# EAGLE design K-Diag small- single_small-multi2 (EAGLE 6.5.0)

## Sheet 1 of 9
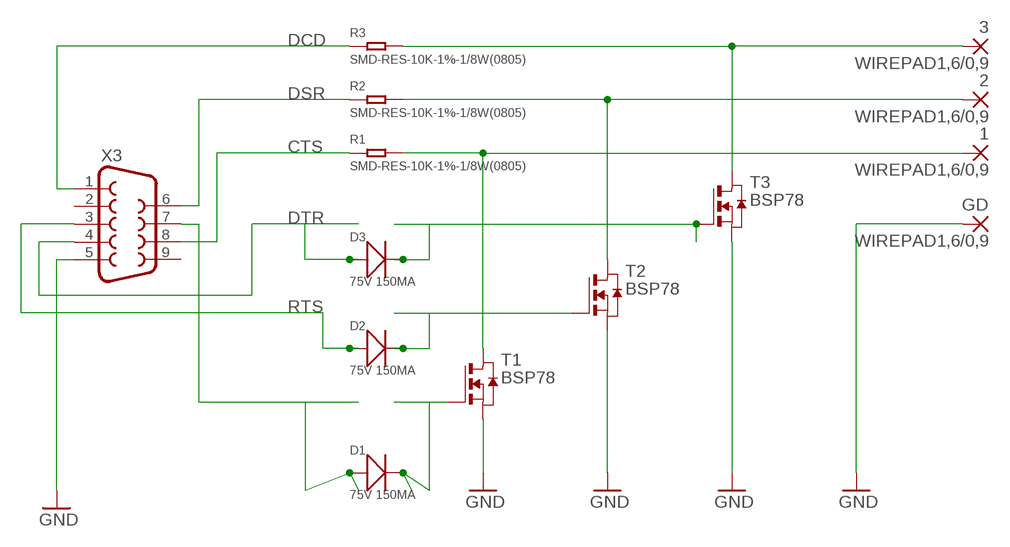
[diagram p0: schematic, sheet 1]

### Parts
1  WIREPAD1,6/0,9  [1,6/0,9]
2  WIREPAD1,6/0,9  [1,6/0,9]
3  WIREPAD1,6/0,9  [1,6/0,9]
D1  75V 150MA  SMD-DIODE-SWITCHING-75V-150MA(D1206)  [LED-1206]
D2  75V 150MA  SMD-DIODE-SWITCHING-75V-150MA(D1206)  [LED-1206]
D3  75V 150MA  SMD-DIODE-SWITCHING-75V-150MA(D1206)  [LED-1206]
GD  WIREPAD1,6/0,9  [1,6/0,9]
R1  SMD-RES-10K-1%-1/8W(0805)  [R0805]
R2  SMD-RES-10K-1%-1/8W(0805)  [R0805]
R3  SMD-RES-10K-1%-1/8W(0805)  [R0805]
T1  BSP78  NMOSSOT223  [SOT223]
T2  BSP78  NMOSSOT223  [SOT223]
T3  BSP78  NMOSSOT223  [SOT223]
X3  F09D  [F09D]

### Nets
CTS: R1.1 X3.8 ; also sheet 2,3,4,5,6,7,8,9
DCD: R3.1 X3.1 ; also sheet 2,3,4,5,6,7,8,9
DSR: R2.1 X3.6 ; also sheet 2,3,4,5,6,7,8,9
DTR: D3.+ X3.4 ; also sheet 2,3,4,5,6,7,8,9
GND: GD.1(P) T1.3(S) T2.3(S) T3.3(S) X3.5 ; also sheet 2,3,4,5,6,7,8,9
N$1: D3.- T3.1(G)
N$2: D2.- T2.1(G)
N$3: D1.- T1.1(G)
N$4: 1.1(P) R1.2 T1.2(D) T1.4(D)
N$5: 2.1(P) R2.2 T2.2(D) T2.4(D)
N$6: 3.1(P) R3.2 T3.2(D) T3.4(D)
N$7: D1.+ X3.7
RTS: D2.+ X3.3 ; also sheet 2,3,4,5,6,7,8,9
Unconnected: X3.2 X3.9

## Sheet 2 of 9
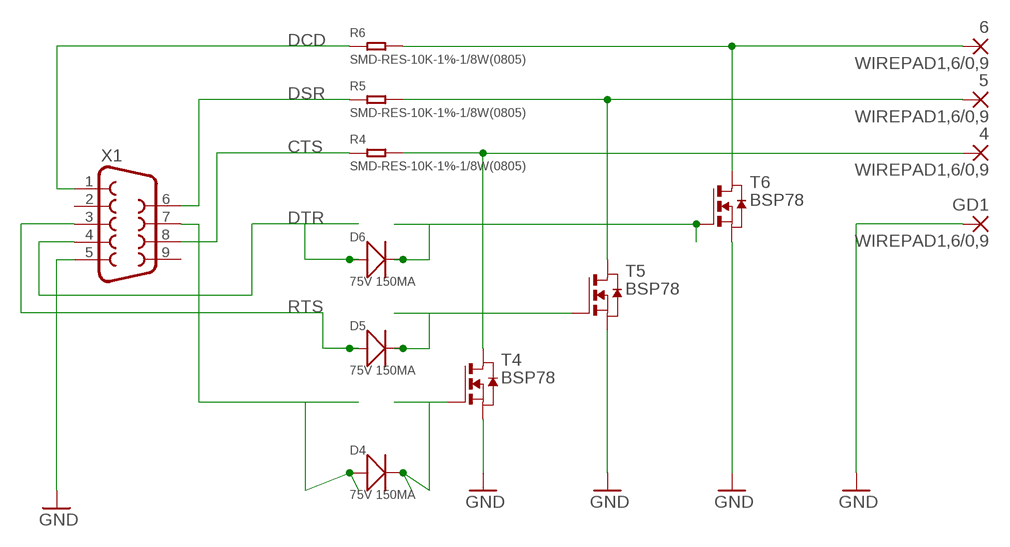
[diagram p1: schematic, sheet 2]

### Parts
4  WIREPAD1,6/0,9  [1,6/0,9]
5  WIREPAD1,6/0,9  [1,6/0,9]
6  WIREPAD1,6/0,9  [1,6/0,9]
D4  75V 150MA  SMD-DIODE-SWITCHING-75V-150MA(D1206)  [LED-1206]
D5  75V 150MA  SMD-DIODE-SWITCHING-75V-150MA(D1206)  [LED-1206]
D6  75V 150MA  SMD-DIODE-SWITCHING-75V-150MA(D1206)  [LED-1206]
GD1  WIREPAD1,6/0,9  [1,6/0,9]
R4  SMD-RES-10K-1%-1/8W(0805)  [R0805]
R5  SMD-RES-10K-1%-1/8W(0805)  [R0805]
R6  SMD-RES-10K-1%-1/8W(0805)  [R0805]
T4  BSP78  NMOSSOT223  [SOT223]
T5  BSP78  NMOSSOT223  [SOT223]
T6  BSP78  NMOSSOT223  [SOT223]
X1  F09D  [F09D]

### Nets
CTS: R4.1 X1.8 ; also sheet 1,3,4,5,6,7,8,9
DCD: R6.1 X1.1 ; also sheet 1,3,4,5,6,7,8,9
DSR: R5.1 X1.6 ; also sheet 1,3,4,5,6,7,8,9
DTR: D6.+ X1.4 ; also sheet 1,3,4,5,6,7,8,9
GND: GD1.1(P) T4.3(S) T5.3(S) T6.3(S) X1.5 ; also sheet 1,3,4,5,6,7,8,9
N$8: D6.- T6.1(G)
N$9: D5.- T5.1(G)
N$10: D4.- T4.1(G)
N$11: 4.1(P) R4.2 T4.2(D) T4.4(D)
N$12: 5.1(P) R5.2 T5.2(D) T5.4(D)
N$13: 6.1(P) R6.2 T6.2(D) T6.4(D)
N$14: D4.+ X1.7
RTS: D5.+ X1.3 ; also sheet 1,3,4,5,6,7,8,9
Unconnected: X1.2 X1.9

## Sheet 3 of 9
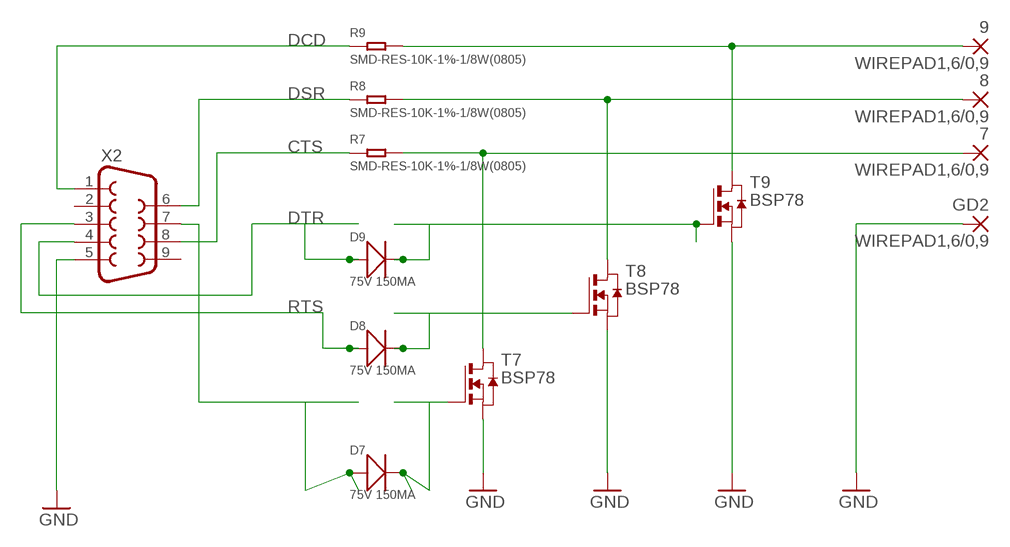
[diagram p2: schematic, sheet 3]

### Parts
7  WIREPAD1,6/0,9  [1,6/0,9]
8  WIREPAD1,6/0,9  [1,6/0,9]
9  WIREPAD1,6/0,9  [1,6/0,9]
D7  75V 150MA  SMD-DIODE-SWITCHING-75V-150MA(D1206)  [LED-1206]
D8  75V 150MA  SMD-DIODE-SWITCHING-75V-150MA(D1206)  [LED-1206]
D9  75V 150MA  SMD-DIODE-SWITCHING-75V-150MA(D1206)  [LED-1206]
GD2  WIREPAD1,6/0,9  [1,6/0,9]
R7  SMD-RES-10K-1%-1/8W(0805)  [R0805]
R8  SMD-RES-10K-1%-1/8W(0805)  [R0805]
R9  SMD-RES-10K-1%-1/8W(0805)  [R0805]
T7  BSP78  NMOSSOT223  [SOT223]
T8  BSP78  NMOSSOT223  [SOT223]
T9  BSP78  NMOSSOT223  [SOT223]
X2  F09D  [F09D]

### Nets
CTS: R7.1 X2.8 ; also sheet 1,2,4,5,6,7,8,9
DCD: R9.1 X2.1 ; also sheet 1,2,4,5,6,7,8,9
DSR: R8.1 X2.6 ; also sheet 1,2,4,5,6,7,8,9
DTR: D9.+ X2.4 ; also sheet 1,2,4,5,6,7,8,9
GND: GD2.1(P) T7.3(S) T8.3(S) T9.3(S) X2.5 ; also sheet 1,2,4,5,6,7,8,9
N$15: D9.- T9.1(G)
N$16: D8.- T8.1(G)
N$17: D7.- T7.1(G)
N$18: 7.1(P) R7.2 T7.2(D) T7.4(D)
N$19: 8.1(P) R8.2 T8.2(D) T8.4(D)
N$20: 9.1(P) R9.2 T9.2(D) T9.4(D)
N$21: D7.+ X2.7
RTS: D8.+ X2.3 ; also sheet 1,2,4,5,6,7,8,9
Unconnected: X2.2 X2.9

## Sheet 4 of 9
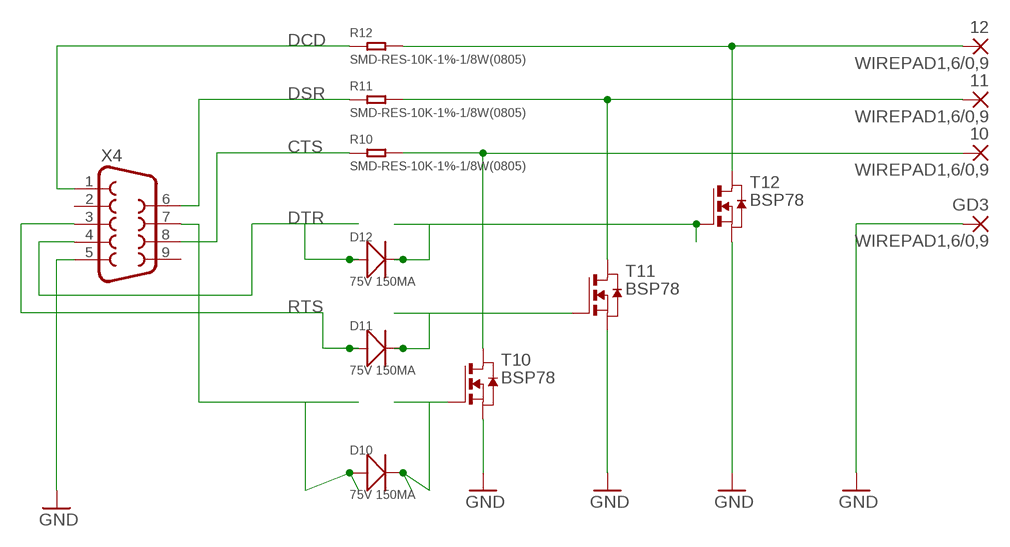
[diagram p3: schematic, sheet 4]

### Parts
10  WIREPAD1,6/0,9  [1,6/0,9]
11  WIREPAD1,6/0,9  [1,6/0,9]
12  WIREPAD1,6/0,9  [1,6/0,9]
D10  75V 150MA  SMD-DIODE-SWITCHING-75V-150MA(D1206)  [LED-1206]
D11  75V 150MA  SMD-DIODE-SWITCHING-75V-150MA(D1206)  [LED-1206]
D12  75V 150MA  SMD-DIODE-SWITCHING-75V-150MA(D1206)  [LED-1206]
GD3  WIREPAD1,6/0,9  [1,6/0,9]
R10  SMD-RES-10K-1%-1/8W(0805)  [R0805]
R11  SMD-RES-10K-1%-1/8W(0805)  [R0805]
R12  SMD-RES-10K-1%-1/8W(0805)  [R0805]
T10  BSP78  NMOSSOT223  [SOT223]
T11  BSP78  NMOSSOT223  [SOT223]
T12  BSP78  NMOSSOT223  [SOT223]
X4  F09D  [F09D]

### Nets
CTS: R10.1 X4.8 ; also sheet 1,2,3,5,6,7,8,9
DCD: R12.1 X4.1 ; also sheet 1,2,3,5,6,7,8,9
DSR: R11.1 X4.6 ; also sheet 1,2,3,5,6,7,8,9
DTR: D12.+ X4.4 ; also sheet 1,2,3,5,6,7,8,9
GND: GD3.1(P) T10.3(S) T11.3(S) T12.3(S) X4.5 ; also sheet 1,2,3,5,6,7,8,9
N$22: D12.- T12.1(G)
N$23: D11.- T11.1(G)
N$24: D10.- T10.1(G)
N$25: 10.1(P) R10.2 T10.2(D) T10.4(D)
N$26: 11.1(P) R11.2 T11.2(D) T11.4(D)
N$27: 12.1(P) R12.2 T12.2(D) T12.4(D)
N$28: D10.+ X4.7
RTS: D11.+ X4.3 ; also sheet 1,2,3,5,6,7,8,9
Unconnected: X4.2 X4.9

## Sheet 5 of 9
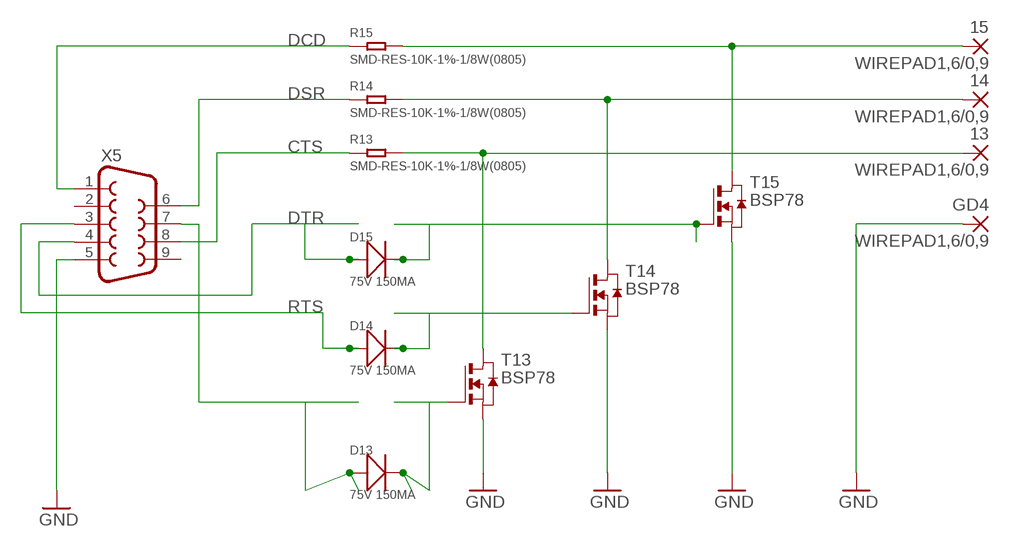
[diagram p4: schematic, sheet 5]

### Parts
13  WIREPAD1,6/0,9  [1,6/0,9]
14  WIREPAD1,6/0,9  [1,6/0,9]
15  WIREPAD1,6/0,9  [1,6/0,9]
D13  75V 150MA  SMD-DIODE-SWITCHING-75V-150MA(D1206)  [LED-1206]
D14  75V 150MA  SMD-DIODE-SWITCHING-75V-150MA(D1206)  [LED-1206]
D15  75V 150MA  SMD-DIODE-SWITCHING-75V-150MA(D1206)  [LED-1206]
GD4  WIREPAD1,6/0,9  [1,6/0,9]
R13  SMD-RES-10K-1%-1/8W(0805)  [R0805]
R14  SMD-RES-10K-1%-1/8W(0805)  [R0805]
R15  SMD-RES-10K-1%-1/8W(0805)  [R0805]
T13  BSP78  NMOSSOT223  [SOT223]
T14  BSP78  NMOSSOT223  [SOT223]
T15  BSP78  NMOSSOT223  [SOT223]
X5  F09D  [F09D]

### Nets
CTS: R13.1 X5.8 ; also sheet 1,2,3,4,6,7,8,9
DCD: R15.1 X5.1 ; also sheet 1,2,3,4,6,7,8,9
DSR: R14.1 X5.6 ; also sheet 1,2,3,4,6,7,8,9
DTR: D15.+ X5.4 ; also sheet 1,2,3,4,6,7,8,9
GND: GD4.1(P) T13.3(S) T14.3(S) T15.3(S) X5.5 ; also sheet 1,2,3,4,6,7,8,9
N$29: D15.- T15.1(G)
N$30: D14.- T14.1(G)
N$31: D13.- T13.1(G)
N$32: 13.1(P) R13.2 T13.2(D) T13.4(D)
N$33: 14.1(P) R14.2 T14.2(D) T14.4(D)
N$34: 15.1(P) R15.2 T15.2(D) T15.4(D)
N$35: D13.+ X5.7
RTS: D14.+ X5.3 ; also sheet 1,2,3,4,6,7,8,9
Unconnected: X5.2 X5.9

## Sheet 6 of 9
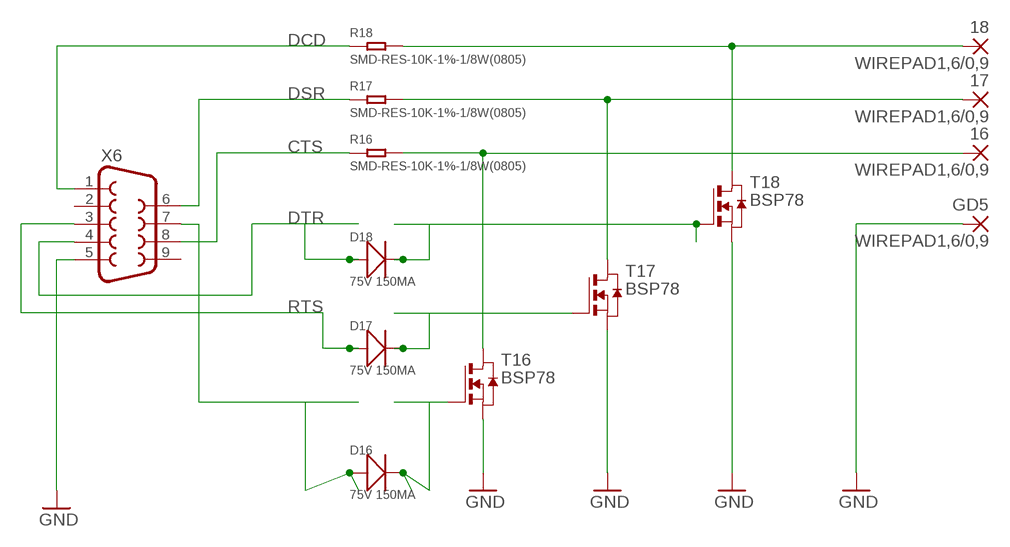
[diagram p5: schematic, sheet 6]

### Parts
16  WIREPAD1,6/0,9  [1,6/0,9]
17  WIREPAD1,6/0,9  [1,6/0,9]
18  WIREPAD1,6/0,9  [1,6/0,9]
D16  75V 150MA  SMD-DIODE-SWITCHING-75V-150MA(D1206)  [LED-1206]
D17  75V 150MA  SMD-DIODE-SWITCHING-75V-150MA(D1206)  [LED-1206]
D18  75V 150MA  SMD-DIODE-SWITCHING-75V-150MA(D1206)  [LED-1206]
GD5  WIREPAD1,6/0,9  [1,6/0,9]
R16  SMD-RES-10K-1%-1/8W(0805)  [R0805]
R17  SMD-RES-10K-1%-1/8W(0805)  [R0805]
R18  SMD-RES-10K-1%-1/8W(0805)  [R0805]
T16  BSP78  NMOSSOT223  [SOT223]
T17  BSP78  NMOSSOT223  [SOT223]
T18  BSP78  NMOSSOT223  [SOT223]
X6  F09D  [F09D]

### Nets
CTS: R16.1 X6.8 ; also sheet 1,2,3,4,5,7,8,9
DCD: R18.1 X6.1 ; also sheet 1,2,3,4,5,7,8,9
DSR: R17.1 X6.6 ; also sheet 1,2,3,4,5,7,8,9
DTR: D18.+ X6.4 ; also sheet 1,2,3,4,5,7,8,9
GND: GD5.1(P) T16.3(S) T17.3(S) T18.3(S) X6.5 ; also sheet 1,2,3,4,5,7,8,9
N$36: D18.- T18.1(G)
N$37: D17.- T17.1(G)
N$38: D16.- T16.1(G)
N$39: 16.1(P) R16.2 T16.2(D) T16.4(D)
N$40: 17.1(P) R17.2 T17.2(D) T17.4(D)
N$41: 18.1(P) R18.2 T18.2(D) T18.4(D)
N$42: D16.+ X6.7
RTS: D17.+ X6.3 ; also sheet 1,2,3,4,5,7,8,9
Unconnected: X6.2 X6.9

## Sheet 7 of 9
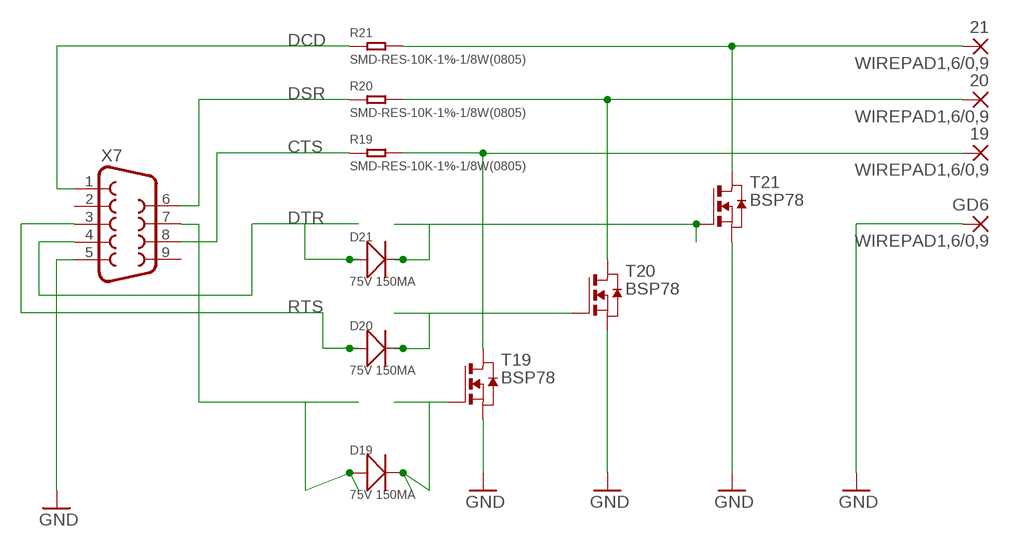
[diagram p6: schematic, sheet 7]

### Parts
19  WIREPAD1,6/0,9  [1,6/0,9]
20  WIREPAD1,6/0,9  [1,6/0,9]
21  WIREPAD1,6/0,9  [1,6/0,9]
D19  75V 150MA  SMD-DIODE-SWITCHING-75V-150MA(D1206)  [LED-1206]
D20  75V 150MA  SMD-DIODE-SWITCHING-75V-150MA(D1206)  [LED-1206]
D21  75V 150MA  SMD-DIODE-SWITCHING-75V-150MA(D1206)  [LED-1206]
GD6  WIREPAD1,6/0,9  [1,6/0,9]
R19  SMD-RES-10K-1%-1/8W(0805)  [R0805]
R20  SMD-RES-10K-1%-1/8W(0805)  [R0805]
R21  SMD-RES-10K-1%-1/8W(0805)  [R0805]
T19  BSP78  NMOSSOT223  [SOT223]
T20  BSP78  NMOSSOT223  [SOT223]
T21  BSP78  NMOSSOT223  [SOT223]
X7  F09D  [F09D]

### Nets
CTS: R19.1 X7.8 ; also sheet 1,2,3,4,5,6,8,9
DCD: R21.1 X7.1 ; also sheet 1,2,3,4,5,6,8,9
DSR: R20.1 X7.6 ; also sheet 1,2,3,4,5,6,8,9
DTR: D21.+ X7.4 ; also sheet 1,2,3,4,5,6,8,9
GND: GD6.1(P) T19.3(S) T20.3(S) T21.3(S) X7.5 ; also sheet 1,2,3,4,5,6,8,9
N$43: D21.- T21.1(G)
N$44: D20.- T20.1(G)
N$45: D19.- T19.1(G)
N$46: 19.1(P) R19.2 T19.2(D) T19.4(D)
N$47: 20.1(P) R20.2 T20.2(D) T20.4(D)
N$48: 21.1(P) R21.2 T21.2(D) T21.4(D)
N$49: D19.+ X7.7
RTS: D20.+ X7.3 ; also sheet 1,2,3,4,5,6,8,9
Unconnected: X7.2 X7.9

## Sheet 8 of 9
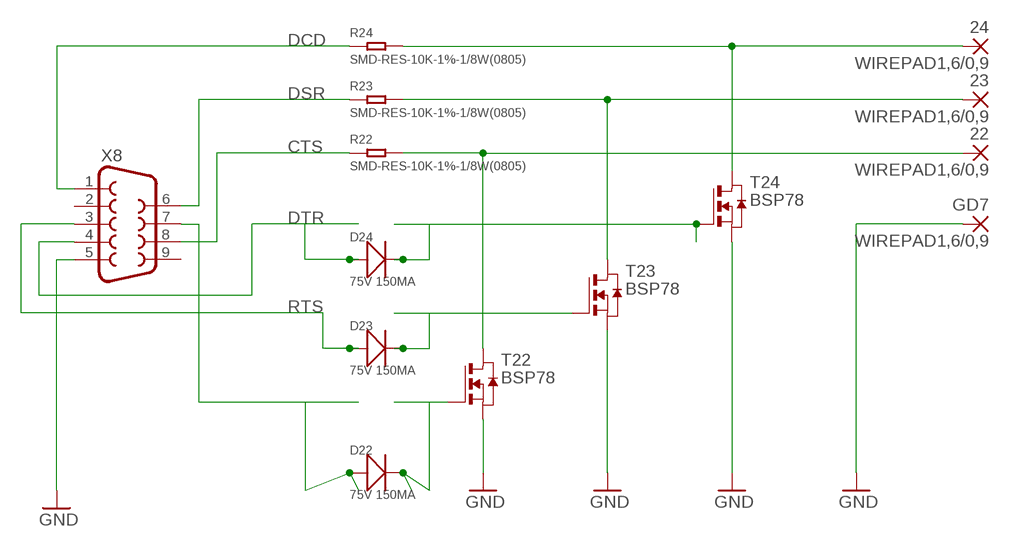
[diagram p7: schematic, sheet 8]

### Parts
22  WIREPAD1,6/0,9  [1,6/0,9]
23  WIREPAD1,6/0,9  [1,6/0,9]
24  WIREPAD1,6/0,9  [1,6/0,9]
D22  75V 150MA  SMD-DIODE-SWITCHING-75V-150MA(D1206)  [LED-1206]
D23  75V 150MA  SMD-DIODE-SWITCHING-75V-150MA(D1206)  [LED-1206]
D24  75V 150MA  SMD-DIODE-SWITCHING-75V-150MA(D1206)  [LED-1206]
GD7  WIREPAD1,6/0,9  [1,6/0,9]
R22  SMD-RES-10K-1%-1/8W(0805)  [R0805]
R23  SMD-RES-10K-1%-1/8W(0805)  [R0805]
R24  SMD-RES-10K-1%-1/8W(0805)  [R0805]
T22  BSP78  NMOSSOT223  [SOT223]
T23  BSP78  NMOSSOT223  [SOT223]
T24  BSP78  NMOSSOT223  [SOT223]
X8  F09D  [F09D]

### Nets
CTS: R22.1 X8.8 ; also sheet 1,2,3,4,5,6,7,9
DCD: R24.1 X8.1 ; also sheet 1,2,3,4,5,6,7,9
DSR: R23.1 X8.6 ; also sheet 1,2,3,4,5,6,7,9
DTR: D24.+ X8.4 ; also sheet 1,2,3,4,5,6,7,9
GND: GD7.1(P) T22.3(S) T23.3(S) T24.3(S) X8.5 ; also sheet 1,2,3,4,5,6,7,9
N$50: D24.- T24.1(G)
N$51: D23.- T23.1(G)
N$52: D22.- T22.1(G)
N$53: 22.1(P) R22.2 T22.2(D) T22.4(D)
N$54: 23.1(P) R23.2 T23.2(D) T23.4(D)
N$55: 24.1(P) R24.2 T24.2(D) T24.4(D)
N$56: D22.+ X8.7
RTS: D23.+ X8.3 ; also sheet 1,2,3,4,5,6,7,9
Unconnected: X8.2 X8.9

## Sheet 9 of 9
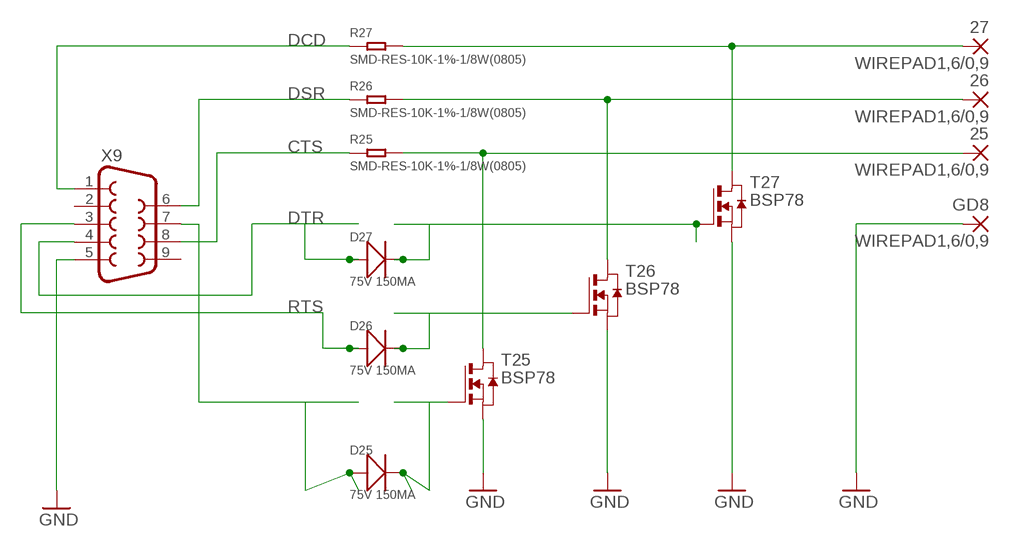
[diagram p8: schematic, sheet 9]

### Parts
25  WIREPAD1,6/0,9  [1,6/0,9]
26  WIREPAD1,6/0,9  [1,6/0,9]
27  WIREPAD1,6/0,9  [1,6/0,9]
D25  75V 150MA  SMD-DIODE-SWITCHING-75V-150MA(D1206)  [LED-1206]
D26  75V 150MA  SMD-DIODE-SWITCHING-75V-150MA(D1206)  [LED-1206]
D27  75V 150MA  SMD-DIODE-SWITCHING-75V-150MA(D1206)  [LED-1206]
GD8  WIREPAD1,6/0,9  [1,6/0,9]
R25  SMD-RES-10K-1%-1/8W(0805)  [R0805]
R26  SMD-RES-10K-1%-1/8W(0805)  [R0805]
R27  SMD-RES-10K-1%-1/8W(0805)  [R0805]
T25  BSP78  NMOSSOT223  [SOT223]
T26  BSP78  NMOSSOT223  [SOT223]
T27  BSP78  NMOSSOT223  [SOT223]
X9  F09D  [F09D]

### Nets
CTS: R25.1 X9.8 ; also sheet 1,2,3,4,5,6,7,8
DCD: R27.1 X9.1 ; also sheet 1,2,3,4,5,6,7,8
DSR: R26.1 X9.6 ; also sheet 1,2,3,4,5,6,7,8
DTR: D27.+ X9.4 ; also sheet 1,2,3,4,5,6,7,8
GND: GD8.1(P) T25.3(S) T26.3(S) T27.3(S) X9.5 ; also sheet 1,2,3,4,5,6,7,8
N$57: D27.- T27.1(G)
N$58: D26.- T26.1(G)
N$59: D25.- T25.1(G)
N$60: 25.1(P) R25.2 T25.2(D) T25.4(D)
N$61: 26.1(P) R26.2 T26.2(D) T26.4(D)
N$62: 27.1(P) R27.2 T27.2(D) T27.4(D)
N$63: D25.+ X9.7
RTS: D26.+ X9.3 ; also sheet 1,2,3,4,5,6,7,8
Unconnected: X9.2 X9.9

## Library data of the parts
1-27 GD GD1-GD8 = wirepad:WIREPAD: Wire PAD connect wire on PCB
D1-D27 = Seeed-Diode-2016:SMD-DIODE-SWITCHING-75V-150MA(D1206): 304040005; MPN: CD1206-S01575
R1-R27 = Seeed-Resistor-2016:SMD-RES-10K-1%-1/8W(0805): 301010361; MPN: RC0805FR-0710KL; VALUE: 10K
T1-T27 = zetex_nmos_BSP78:NMOSSOT223: MOS FET; OC_FARNELL: unknown; OC_NEWARK: unknown
X1-X9 = con-subd_Kdiag:F09: SUB-D; OC_FARNELL: unknown; OC_NEWARK: unknown

## Board
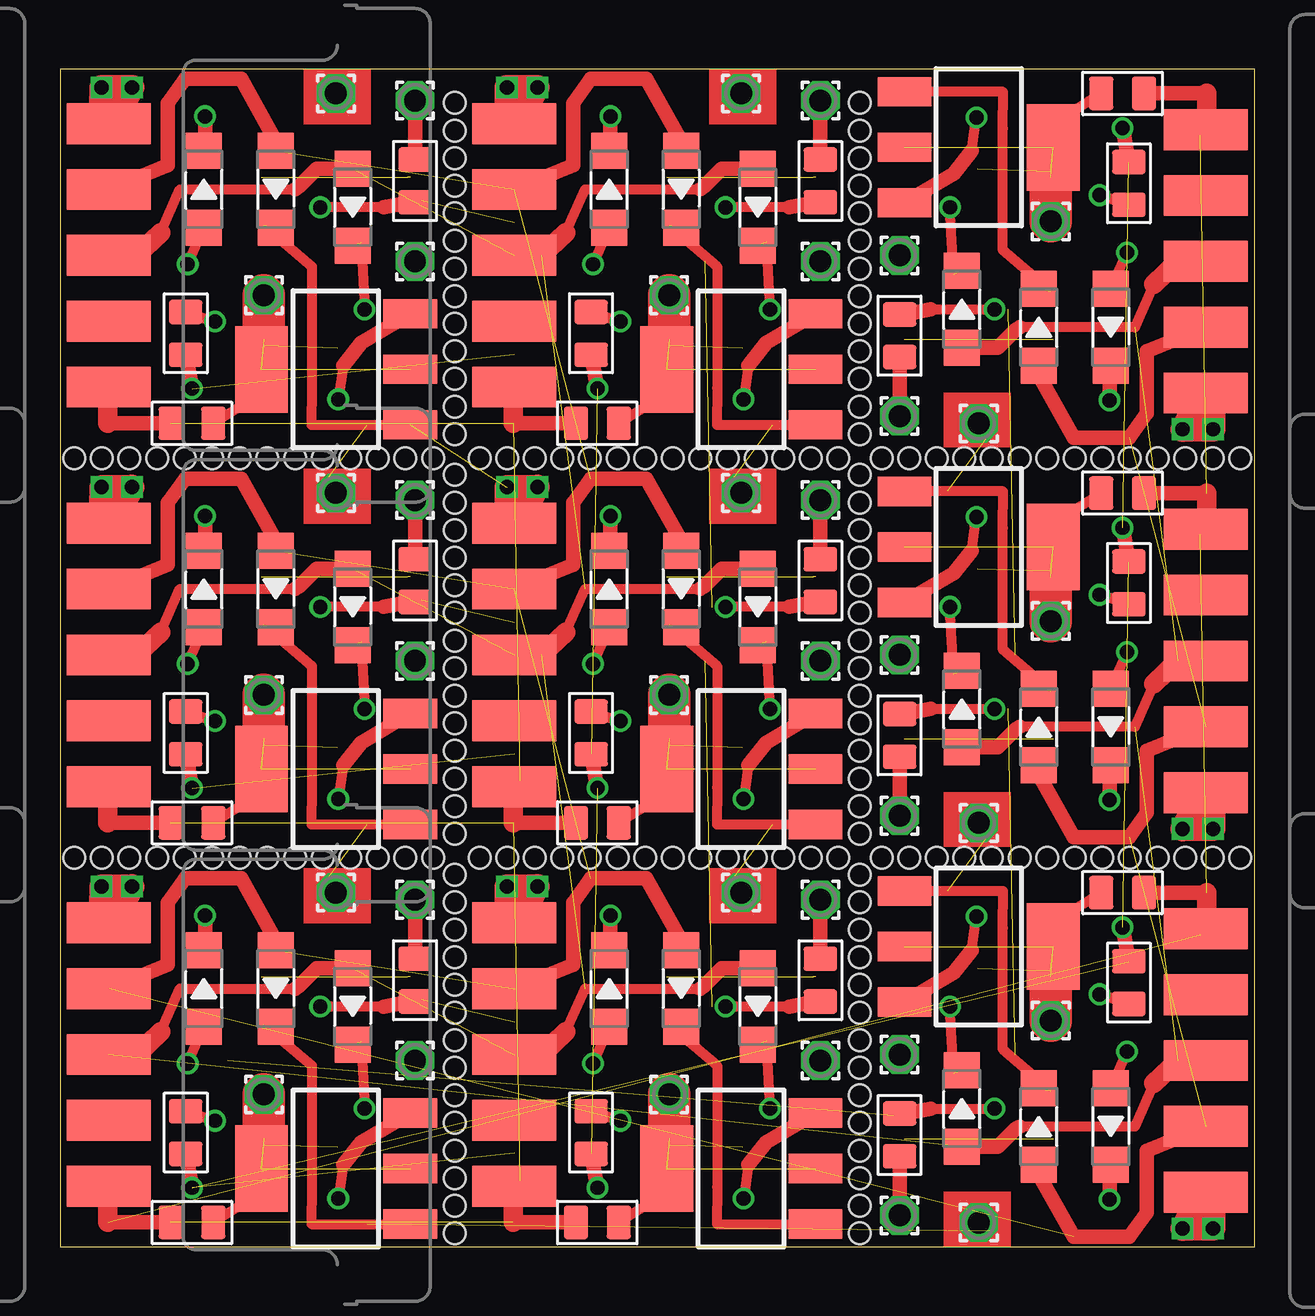
[diagram p9: board, top side]
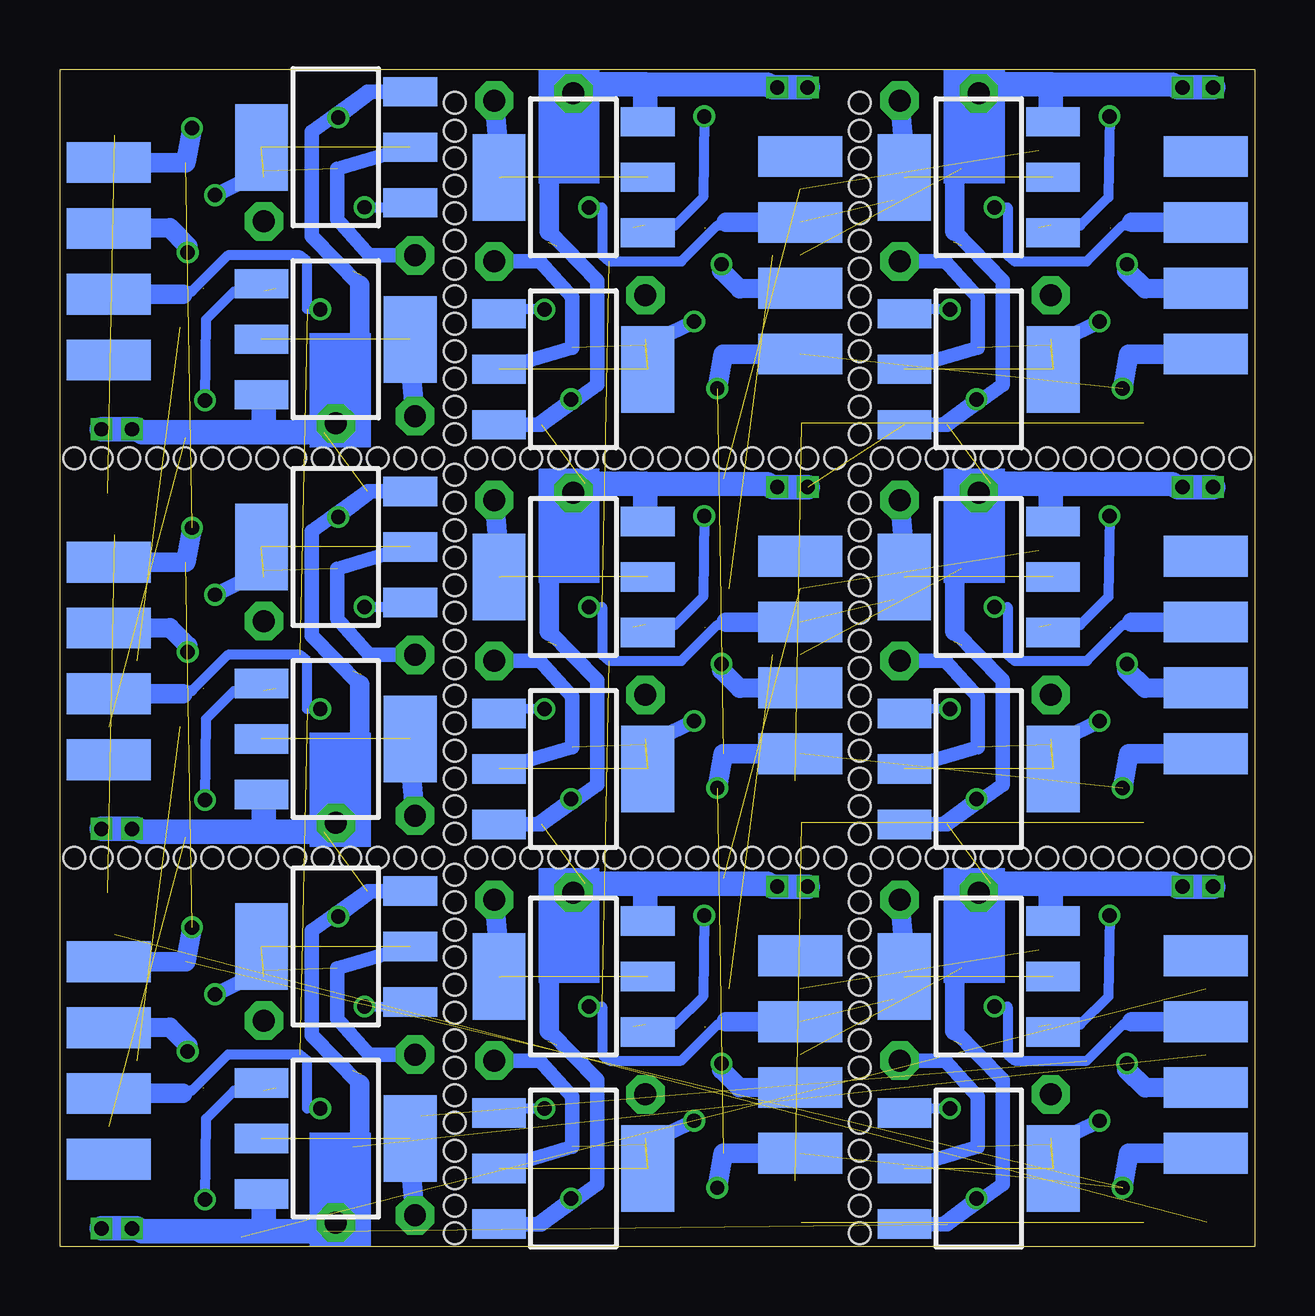
[diagram p10: board, bottom side, seen from below]

Size 49.77 x 49.05 mm. Coordinates in mm from the lower left corner, seen from the top.
Outline: 0,0 49.77,0 49.77,49.05 0,49.05 0,33.3 0,0
Copper layers (1*16): Top 0.035mm / dielectric 1.5mm / Bottom 0.035mm
Design rules "SeeedStudio_2layer_DRU_no_angle_20140221 *": minimum track width 6mil, minimum drill 12mil, track to track 6mil, track to pad 6mil, pad to pad 6mil, via to via 6mil, smd to smd 0mil, copper to edge 10mil, drill to drill 10mil, minimum pad ring 10mil, minimum via ring 6mil, stop-mask expansion 2mil, vias tented up to drill 100mil, thermal gap 10mil
Holes 0.9 mm at 16.44,0.55 16.44,1.7 16.44,2.85 16.44,4 16.44,5.15 16.44,6.3 16.44,7.45 16.44,8.6 16.44,9.75 16.44,10.9 16.44,12.05 16.44,13.2 16.44,14.35 16.44,15.5 0.59,16.2 0.59,16.2 1.74,16.2 2.89,16.2 4.04,16.2 5.19,16.2 6.34,16.2 7.49,16.2 8.64,16.2 9.79,16.2 10.94,16.2 12.09,16.2 13.24,16.2 14.39,16.2 15.54,16.2 16.44,17.2 16.44,18.35 16.44,19.5 16.44,20.65 16.44,21.8 16.44,22.95 16.44,24.1 16.44,25.25 16.44,26.4 16.44,27.55 16.44,28.7 16.44,29.85 16.44,31 16.44,32.15 0.59,32.85 0.59,32.85 1.74,32.85 2.89,32.85 4.04,32.85 5.19,32.85 6.34,32.85 7.49,32.85 8.64,32.85 9.79,32.85 10.94,32.85 12.09,32.85 13.24,32.85 14.39,32.85 15.54,32.85 16.44,33.85 16.44,35 16.44,36.15 16.44,37.3 16.44,38.45 16.44,39.6 16.44,40.75 16.44,41.9 16.44,43.05 16.44,44.2 16.44,45.35 16.44,46.5 16.44,47.65 33.33,0.55 33.33,1.7 33.33,2.85 33.33,4 33.33,5.15 33.33,6.3 33.33,7.45 33.33,8.6 33.33,9.75 33.33,10.9 33.33,12.05 33.33,13.2 33.33,14.35 33.33,15.5 17.48,16.2 17.48,16.2 18.63,16.2 19.78,16.2 20.93,16.2 22.08,16.2 23.23,16.2 24.38,16.2 25.53,16.2 26.68,16.2 27.83,16.2 28.98,16.2 30.13,16.2 31.28,16.2 32.43,16.2 33.33,17.2 33.33,18.35 33.33,19.5 33.33,20.65 33.33,21.8 33.33,22.95 33.33,24.1 33.33,25.25 33.33,26.4 33.33,27.55 33.33,28.7 33.33,29.85 33.33,31 33.33,32.15 17.48,32.85 17.48,32.85 18.63,32.85 19.78,32.85 20.93,32.85 22.08,32.85 23.23,32.85 24.38,32.85 25.53,32.85 26.68,32.85 27.83,32.85 28.98,32.85 30.13,32.85 31.28,32.85 32.43,32.85 33.33,33.85 33.33,35 33.33,36.15 33.33,37.3 33.33,38.45 33.33,39.6 33.33,40.75 33.33,41.9 33.33,43.05 33.33,44.2 33.33,45.35 33.33,46.5 33.33,47.65 49.18,32.85 49.18,32.85 48.03,32.85 46.88,32.85 45.73,32.85 44.58,32.85 43.43,32.85 42.28,32.85 41.13,32.85 39.98,32.85 38.83,32.85 37.68,32.85 36.53,32.85 35.38,32.85 34.23,32.85 49.18,16.2 49.18,16.2 48.03,16.2 46.88,16.2 45.73,16.2 44.58,16.2 43.43,16.2 42.28,16.2 41.13,16.2 39.98,16.2 38.83,16.2 37.68,16.2 36.53,16.2 35.38,16.2 34.23,16.2

### Footprints (pad centres in the part's own frame; a part is rotated, then mirrored left to right if it is on the bottom)
1,6/0,9 = drill 0.914 pad 1.6 octagon: 1 0,0
LED-1206 = smd 1.5 x 1.5: + -1.6,0; - 1.6,0
R0805 = smd 1.397 x 1.016: 1 0,0.889; 2 0,-0.889
SOT223 = smd 1.219 x 2.235: 1 -2.311,-3.099; 2 0,-3.099; 3 2.311,-3.099 | smd 3.6 x 2.2: 4 0,3.099
F09D = smd 1.7 x 3.5: 1 -5.486,-6.045; 2 -2.743,-6.045; 3 0,-6.045; 4 2.743,-6.045; 5 5.486,-6.045 | smd 1.7 x 3.5 bottom: 6 -4.115,-6.045; 7 -1.372,-6.045; 8 1.372,-6.045; 9 4.115,-6.045

### Placement (x,y rotation side)
1  14.79,14.45 0 top
2  14.79,7.75 0 top
3  8.49,6.34 0 top
4  14.79,31.1 0 top
5  14.79,24.4 0 top
6  8.49,22.99 0 top
7  14.79,47.75 0 top
8  14.79,41.05 0 top
9  8.49,39.64 0 top
10  31.68,14.45 0 top
11  31.68,7.75 0 top
12  25.38,6.34 0 top
13  31.68,31.1 0 top
14  31.68,24.4 0 top
15  25.38,22.99 0 top
16  31.68,47.75 0 top
17  31.68,41.05 0 top
18  25.38,39.64 0 top
19  34.98,34.6 180 top
20  34.98,41.3 180 top
21  41.28,42.71 180 top
22  34.98,17.95 180 top
23  34.98,24.65 180 top
24  41.28,26.06 180 top
25  34.98,1.3 180 top
26  34.98,8 180 top
27  41.28,9.41 180 top
D1  5.99,10.75 90 top
D2  12.19,10 270 top
D3  8.99,10.75 270 top
D4  5.99,27.4 90 top
D5  12.19,26.65 270 top
D6  8.99,27.4 270 top
D7  5.99,44.05 90 top
D8  12.19,43.3 270 top
D9  8.99,44.05 270 top
D10  22.88,10.75 90 top
D11  29.08,10 270 top
D12  25.88,10.75 270 top
D13  22.88,27.4 90 top
D14  29.08,26.65 270 top
D15  25.88,27.4 270 top
D16  22.88,44.05 90 top
D17  29.08,43.3 270 top
D18  25.88,44.05 270 top
D19  43.78,38.3 270 top
D20  37.58,39.05 90 top
D21  40.78,38.3 90 top
D22  43.78,21.65 270 top
D23  37.58,22.4 90 top
D24  40.78,21.65 90 top
D25  43.78,5 270 top
D26  37.58,5.75 90 top
D27  40.78,5 90 top
GD  11.49,14.75 0 top
GD1  11.49,31.4 0 top
GD2  11.49,48.05 0 top
GD3  28.38,14.75 0 top
GD4  28.38,31.4 0 top
GD5  28.38,48.05 0 top
GD6  38.28,34.3 180 top
GD7  38.28,17.65 180 top
GD8  38.28,1 180 top
R1  14.79,11.1 180 top
R2  5.24,4.75 180 top
R3  5.5,1 90 top
R4  14.79,27.75 180 top
R5  5.24,21.4 180 top
R6  5.5,17.65 90 top
R7  14.79,44.4 180 top
R8  5.24,38.05 180 top
R9  5.5,34.3 90 top
R10  31.68,11.1 180 top
R11  22.13,4.75 180 top
R12  22.39,1 90 top
R13  31.68,27.75 180 top
R14  22.13,21.4 180 top
R15  22.39,17.65 90 top
R16  31.68,44.4 180 top
R17  22.13,38.05 180 top
R18  22.39,34.3 90 top
R19  34.98,37.95 0 top
R20  44.54,44.3 0 top
R21  44.27,48.05 270 top
R22  34.98,21.3 0 top
R23  44.54,27.65 0 top
R24  44.27,31.4 270 top
R25  34.98,4.65 0 top
R26  44.54,11 0 top
R27  44.27,14.75 270 top
T1  11.49,11.25 90 bottom
T2  11.49,3.25 270 bottom
T3  11.49,3.25 90 top
T4  11.49,27.9 90 bottom
T5  11.49,19.9 270 bottom
T6  11.49,19.9 90 top
T7  11.49,44.55 90 bottom
T8  11.49,36.55 270 bottom
T9  11.49,36.55 90 top
T10  28.38,11.25 90 bottom
T11  28.38,3.25 270 bottom
T12  28.38,3.25 90 top
T13  28.38,27.9 90 bottom
T14  28.38,19.9 270 bottom
T15  28.38,19.9 90 top
T16  28.38,44.55 90 bottom
T17  28.38,36.55 270 bottom
T18  28.38,36.55 90 top
T19  38.28,37.8 270 bottom
T20  38.28,45.8 90 bottom
T21  38.28,45.8 270 top
T22  38.28,21.15 270 bottom
T23  38.28,29.15 90 bottom
T24  38.28,29.15 270 top
T25  38.28,4.5 270 bottom
T26  38.28,12.5 90 bottom
T27  38.28,12.5 270 top
X1  -4.01,24.65 90 top
X2  -4.01,41.3 90 top
X3  -4.01,8 90 top
X4  12.88,8 90 top
X5  12.88,24.65 90 top
X6  12.88,41.3 90 top
X7  53.78,41.05 270 top
X8  53.78,24.4 270 top
X9  53.78,7.75 270 top

### Tracks (layer width: path | path; a pad name or v marks a point on that pad's centre or on a via)
CTS  (via drill 0.6)  (8 unrouted)
  Top 0.406: 13.49,10 v10.84,10 | 13.49,26.65 v10.84,26.65 | 13.49,43.3 v10.84,43.3 | 30.38,10 v27.73,10 | 30.38,26.65 v27.73,26.65 | 30.38,43.3 v27.73,43.3 | 36.28,39.05 v38.93,39.05 | 36.28,22.4 v38.93,22.4 | 36.28,5.75 v38.93,5.75
  Top 0.61: R1.1 15.04,10.3 13.49,10 | R4.1 15.04,26.95 13.49,26.65 | R7.1 15.04,43.6 13.49,43.3 | R10.1 31.93,10.3 30.38,10 | R13.1 31.93,26.95 30.38,26.65 | R16.1 31.93,43.6 30.38,43.3 | R19.1 34.73,38.75 36.28,39.05 | R22.1 34.73,22.1 36.28,22.4 | R25.1 34.73,5.45 36.28,5.75
  Bottom 0.406: v10.84,10 10.29,10 10.29,8 9.99,7.75 6.99,7.75 5.49,9.25 5.24,9.25 5.11,9.37 | v10.84,26.65 10.29,26.65 10.29,24.65 9.99,24.4 6.99,24.4 5.49,25.9 5.24,25.9 5.11,26.02 | v10.84,43.3 10.29,43.3 10.29,41.3 9.99,41.05 6.99,41.05 5.49,42.55 5.24,42.55 5.11,42.67 | v27.73,10 27.18,10 27.18,8 26.88,7.75 23.88,7.75 22.38,9.25 22.12,9.25 22,9.37 | v27.73,26.65 27.18,26.65 27.18,24.65 26.88,24.4 23.88,24.4 22.38,25.9 22.12,25.9 22,26.02 | v27.73,43.3 27.18,43.3 27.18,41.3 26.88,41.05 23.88,41.05 22.38,42.55 22.12,42.55 22,42.67 | v38.93,39.05 39.48,39.05 39.48,41.05 39.78,41.3 42.78,41.3 44.28,39.8 44.54,39.8 44.66,39.68 | v38.93,22.4 39.48,22.4 39.48,24.4 39.78,24.65 42.78,24.65 44.28,23.15 44.54,23.15 44.66,23.03 | v38.93,5.75 39.48,5.75 39.48,7.75 39.78,8 42.78,8 44.28,6.5 44.54,6.5 44.66,6.38
  Bottom 0.813: X3.8 5.11,9.37 | X1.8 5.11,26.02 | X2.8 5.11,42.67 | X4.8 22,9.37 | X5.8 22,26.02 | X6.8 22,42.67 | X7.8 44.66,39.68 | X8.8 44.66,23.03 | X9.8 44.66,6.38
DCD  (8 unrouted)
  Top 0.406: 2.27,2.75 X3.1 | 2.27,19.4 X1.1 | 2.27,36.05 X2.1 | 19.16,2.75 X4.1 | 19.16,19.4 X5.1 | 19.16,36.05 X6.1 | 47.5,46.3 X7.1 | 47.5,29.65 X8.1 | 47.5,13 X9.1
  Top 0.61: R3.1 1.99,1 | R6.1 1.99,17.65 | R9.1 1.99,34.3 | R12.1 18.88,1 | R15.1 18.88,17.65 | R18.1 18.88,34.3 | R21.1 47.78,48.05 | R24.1 47.78,31.4 | R27.1 47.78,14.75
  Top 0.813: 1.99,1 1.99,2.25 2.27,2.75 | 1.99,17.65 1.99,18.9 2.27,19.4 | 1.99,34.3 1.99,35.55 2.27,36.05 | 18.88,1 18.88,2.25 19.16,2.75 | 18.88,17.65 18.88,18.9 19.16,19.4 | 18.88,34.3 18.88,35.55 19.16,36.05 | 47.78,48.05 47.78,46.8 47.5,46.3 | 47.78,31.4 47.78,30.15 47.5,29.65 | 47.78,14.75 47.78,13.5 47.5,13
DSR  (via drill 0.6)  (8 unrouted)
  Top 0.61: v5.5,2.45 R2.1 | v5.5,19.1 R5.1 | v5.5,35.75 R8.1 | v22.39,2.45 R11.1 | v22.39,19.1 R14.1 | v22.39,35.75 R17.1 | v44.27,46.6 R20.1 | v44.27,29.95 R23.1 | v44.27,13.3 R26.1
  Bottom 0.813: X3.6 5.25,3.88 v5.5,2.45 | X1.6 5.25,20.54 v5.5,19.1 | X2.6 5.25,37.19 v5.5,35.75 | X4.6 22.14,3.88 v22.39,2.45 | X5.6 22.14,20.54 v22.39,19.1 | X6.6 22.14,37.19 v22.39,35.75 | X7.6 44.53,45.16 v44.27,46.6 | X8.6 44.53,28.52 v44.27,29.95 | X9.6 44.53,11.87 v44.27,13.3
DTR  (8 unrouted)
  Top 0.406: 2.04,10.75 X3.4 | 2.04,27.4 X1.4 | 2.04,44.05 X2.4 | X4.4 | X5.4 | X6.4 | 47.73,38.3 X7.4 | 47.73,21.65 X8.4 | 47.73,5 X9.4
  Top 0.61: 2.04,10.75 4.49,11.75 4.49,14.33 5.22,15.35 7.54,15.35 8.99,12.75 D3.+ | 2.04,27.4 4.49,28.4 4.49,30.98 5.22,32 7.54,32 8.99,29.4 D6.+ | 2.04,44.05 4.49,45.05 4.49,47.63 5.22,48.65 7.54,48.65 8.99,46.05 D9.+ | X4.4 21.38,11.75 21.38,14.33 22.11,15.35 24.43,15.35 25.88,12.75 D12.+ | X5.4 21.38,28.4 21.38,30.98 22.11,32 24.43,32 25.88,29.4 D15.+ | X6.4 21.38,45.05 21.38,47.63 22.11,48.65 24.43,48.65 25.88,46.05 D18.+ | 47.73,38.3 45.28,37.3 45.28,34.72 44.55,33.7 42.23,33.7 40.78,36.3 D21.+ | 47.73,21.65 45.28,20.65 45.28,18.07 44.55,17.05 42.23,17.05 40.78,19.65 D24.+ | 47.73,5 45.28,4 45.28,1.42 44.55,0.4 42.23,0.4 40.78,3 D27.+
GND  (via drill 0.6)  (8 unrouted)
  Top 0.406: X3.5 2.23,13.49 | 11.79,3.4 v11.59,2 | X1.5 2.23,30.14 | 11.79,20.05 v11.59,18.65 | X2.5 2.23,46.79 | 11.79,36.7 v11.59,35.3 | X4.5 19.12,13.49 | 28.68,3.4 v28.48,2 | X5.5 19.12,30.14 | 28.68,20.05 v28.48,18.65 | X6.5 19.12,46.79 | 28.68,36.7 v28.48,35.3 | X7.5 47.55,35.56 | 37.98,45.65 v38.18,47.05 | X8.5 47.55,18.91 | 37.98,29 v38.18,30.4 | X9.5 47.55,2.26 | 37.98,12.35 v38.18,13.75
  Top 0.61: T3.3 12.54,4.35 11.79,3.4 | T6.3 12.54,21 11.79,20.05 | T9.3 12.54,37.65 11.79,36.7 | T12.3 29.43,4.35 28.68,3.4 | T15.3 29.43,21 28.68,20.05 | T18.3 29.43,37.65 28.68,36.7 | T21.3 37.23,44.7 37.98,45.65 | T24.3 37.23,28.05 37.98,29 | T27.3 37.23,11.4 37.98,12.35
  Top 1.016: 2.73,13.49 2.23,13.49 v3,15 | 2.99,15.01 v1.73,15 1.72,14.25 | 2.73,30.14 2.23,30.14 v3,31.65 | 2.99,31.66 v1.73,31.65 1.72,30.9 | 2.73,46.79 2.23,46.79 v3,48.3 | 2.99,48.31 v1.73,48.3 1.72,47.55 | 19.62,13.49 19.12,13.49 v19.89,15 | 19.88,15.01 v18.62,15 18.61,14.25 | 19.62,30.14 19.12,30.14 v19.89,31.65 | 19.88,31.66 v18.62,31.65 18.61,30.9 | 19.62,46.79 19.12,46.79 v19.89,48.3 | 19.88,48.31 v18.62,48.3 18.61,47.55 | 47.05,35.56 47.55,35.56 v46.77,34.05 | 46.78,34.04 v48.04,34.05 48.05,34.8 | 47.05,18.91 47.55,18.91 v46.77,17.4 | 46.78,17.39 v48.04,17.4 48.05,18.15 | 47.05,2.26 47.55,2.26 v46.77,0.75 | 46.78,0.74 v48.04,0.75 48.05,1.5
  Bottom 0.61: T2.3 12.99,0.94 | 12.99,0.94 12.8,0.94 10.49,2.6 10.49,6.95 12.49,9 | v11.59,2 v11.59,1.99 12.99,0.94 | T5.3 12.99,17.59 | 12.99,17.59 12.8,17.59 10.49,19.25 10.49,23.6 12.49,25.65 | v11.59,18.65 11.59,18.64 12.99,17.59 | T8.3 12.99,34.24 | 12.99,34.24 12.8,34.24 10.49,35.9 10.49,40.25 12.49,42.3 | v11.59,35.3 v11.59,35.29 12.99,34.24 | T11.3 29.88,0.94 | 29.88,0.94 29.69,0.94 27.38,2.6 27.38,6.95 29.38,9 | v28.48,2 v28.48,1.99 29.88,0.94 | T14.3 29.88,17.59 | 29.88,17.59 29.69,17.59 27.38,19.25 27.38,23.6 29.38,25.65 | v28.48,18.65 28.48,18.64 29.88,17.59 | T17.3 29.88,34.24 | 29.88,34.24 29.69,34.24 27.38,35.9 27.38,40.25 29.38,42.3 | v28.48,35.3 v28.48,35.29 29.88,34.24 | T20.3 36.78,48.11 | 36.78,48.11 36.97,48.11 39.28,46.45 39.28,42.1 37.28,40.05 | v38.18,47.05 v38.18,47.06 36.78,48.11 | T23.3 36.78,31.46 | 36.78,31.46 36.97,31.46 39.28,29.8 39.28,25.45 37.28,23.4 | v38.18,30.4 38.18,30.41 36.78,31.46 | T26.3 36.78,14.81 | 36.78,14.81 36.97,14.81 39.28,13.15 39.28,8.8 37.28,6.75 | v38.18,13.75 v38.18,13.76 36.78,14.81
  Bottom 0.813: 12.49,9 12.49,14.25 GD.1 | 12.49,25.65 12.49,30.9 GD1.1 | 12.49,42.3 12.49,47.55 GD2.1 | 29.38,9 29.38,14.25 GD3.1 | 29.38,25.65 29.38,30.9 GD4.1 | 29.38,42.3 29.38,47.55 GD5.1 | 37.28,40.05 37.28,34.8 GD6.1 | 37.28,23.4 37.28,18.15 GD7.1 | 37.28,6.75 37.28,1.5 GD8.1
  Bottom 1.016: 8.49,15.12 3.42,15.12 3.17,15 v3,15 v1.73,15 | T1.3 8.49,13.56 8.49,15.12 | 8.49,15.12 10.99,15.12 GD.1 | 8.49,31.77 3.42,31.77 3.17,31.65 v3,31.65 v1.73,31.65 | T4.3 8.49,30.21 8.49,31.77 | 8.49,31.77 10.99,31.77 GD1.1 | 8.49,48.42 3.42,48.42 3.17,48.3 v3,48.3 v1.73,48.3 | T7.3 8.49,46.86 8.49,48.42 | 8.49,48.42 10.99,48.42 GD2.1 | 25.38,15.12 20.31,15.12 20.06,15 v19.89,15 v18.62,15 | T10.3 25.38,13.56 25.38,15.12 | 25.38,15.12 27.88,15.12 GD3.1 | 25.38,31.77 20.31,31.77 20.06,31.65 v19.89,31.65 v18.62,31.65 | T13.3 25.38,30.21 25.38,31.77 | 25.38,31.77 27.88,31.77 GD4.1 | 25.38,48.42 20.31,48.42 20.06,48.3 v19.89,48.3 v18.62,48.3 | T16.3 25.38,46.86 25.38,48.42 | 25.38,48.42 27.88,48.42 GD5.1 | 41.28,33.93 46.35,33.93 46.6,34.05 v46.77,34.05 v48.04,34.05 | T19.3 41.28,35.49 41.28,33.93 | 41.28,33.93 38.78,33.93 GD6.1 | 41.28,17.28 46.35,17.28 46.6,17.4 v46.77,17.4 v48.04,17.4 | T22.3 41.28,18.84 41.28,17.28 | 41.28,17.28 38.78,17.28 GD7.1 | 41.28,0.63 46.35,0.63 46.6,0.75 v46.77,0.75 v48.04,0.75 | T25.3 41.28,2.19 41.28,0.63 | 41.28,0.63 38.78,0.63 GD8.1
N$1  (1 unrouted)
  Top 0.406: 8.49,9.25 10.49,7.54 10.49,2.47 10.48,0.94 T3.1
N$2  (via drill 0.6)  (1 unrouted)
  Top 0.406: 12.54,8.55 v12.69,5.75
  Bottom 0.406: v12.69,5.75 14.4,5.75 T2.1
N$3  (via drill 0.6)
  Top 0.61: v6.04,13.79 6.04,12.8 D1.-
  Bottom 0.406: v6.04,13.79 6.09,10.42 7.25,9.25 8.21,9.25 T1.1
N$4  (2 unrouted)
  Top 0.61: R1.2 1.1
  Bottom 0.813: 14.49,11.25 1.1
N$5  (via drill 0.6)  (2 unrouted)
  Top 0.406: R2.2 v6.46,5.24
  Bottom 0.61: v6.46,5.24 8.49,4.25 | 2.1 12.89,7.75 11.54,6.25 11.54,4.15 T2.2
N$6  (2 unrouted)
  Top 0.406: R3.2 7.99,2.01
  Top 0.61: 7.99,2.01 8.49,4.5
  Top 1.778: 3.1 8.49,4.5
N$7  (via drill 0.6)  (1 unrouted)
  Top 0.406: v5.32,7.63 5.99,9.13 5.99,9.25
  Bottom 0.813: X3.7 4.56,6.61 5.32,7.36 v5.32,7.63
N$8  (1 unrouted)
  Top 0.406: 8.49,25.9 10.49,24.19 10.49,19.12 10.48,17.59 T6.1
N$9  (via drill 0.6)  (1 unrouted)
  Top 0.406: 12.54,25.2 v12.69,22.4
  Bottom 0.406: v12.69,22.4 14.4,22.4 T5.1
N$10  (via drill 0.6)
  Top 0.61: v6.04,30.44 6.04,29.45 D4.-
  Bottom 0.406: v6.04,30.44 6.09,27.07 7.25,25.9 8.21,25.9 T4.1
N$11  (2 unrouted)
  Top 0.61: R4.2 4.1
  Bottom 0.813: 14.49,27.9 4.1
N$12  (via drill 0.6)  (2 unrouted)
  Top 0.406: R5.2 v6.46,21.89
  Bottom 0.61: v6.46,21.89 8.49,20.9 | 5.1 12.89,24.4 11.54,22.9 11.54,20.8 T5.2
N$13  (2 unrouted)
  Top 0.406: R6.2 7.99,18.66
  Top 0.61: 7.99,18.66 8.49,21.15
  Top 1.778: 6.1 8.49,21.15
N$14  (via drill 0.6)  (1 unrouted)
  Top 0.406: v5.32,24.28 5.99,25.78 5.99,25.9
  Bottom 0.813: X1.7 4.56,23.26 5.32,24.01 v5.32,24.28
N$15  (1 unrouted)
  Top 0.406: 8.49,42.55 10.49,40.84 10.49,35.77 10.48,34.24 T9.1
N$16  (via drill 0.6)  (1 unrouted)
  Top 0.406: 12.54,41.85 v12.69,39.05
  Bottom 0.406: v12.69,39.05 14.4,39.05 T8.1
N$17  (via drill 0.6)
  Top 0.61: v6.04,47.09 6.04,46.1 D7.-
  Bottom 0.406: v6.04,47.09 6.09,43.72 7.25,42.55 8.21,42.55 T7.1
N$18  (2 unrouted)
  Top 0.61: R7.2 7.1
  Bottom 0.813: 14.49,44.55 7.1
N$19  (via drill 0.6)  (2 unrouted)
  Top 0.406: R8.2 v6.46,38.54
  Bottom 0.61: v6.46,38.54 8.49,37.55 | 8.1 12.89,41.05 11.54,39.55 11.54,37.45 T8.2
N$20  (2 unrouted)
  Top 0.406: R9.2 7.99,35.31
  Top 0.61: 7.99,35.31 8.49,37.8
  Top 1.778: 9.1 8.49,37.8
N$21  (via drill 0.6)  (1 unrouted)
  Top 0.406: v5.32,40.93 5.99,42.43 5.99,42.55
  Bottom 0.813: X2.7 4.56,39.91 5.32,40.66 v5.32,40.93
N$22  (1 unrouted)
  Top 0.406: 25.38,9.25 27.38,7.54 27.38,2.47 27.37,0.94 T12.1
N$23  (via drill 0.6)  (1 unrouted)
  Top 0.406: 29.43,8.55 v29.58,5.75
  Bottom 0.406: v29.58,5.75 31.29,5.75 T11.1
N$24  (via drill 0.6)
  Top 0.61: v22.93,13.79 22.93,12.8 D10.-
  Bottom 0.406: v22.93,13.79 22.98,10.42 24.14,9.25 25.1,9.25 T10.1
N$25  (2 unrouted)
  Top 0.61: R10.2 10.1
  Bottom 0.813: 31.38,11.25 10.1
N$26  (via drill 0.6)  (2 unrouted)
  Top 0.406: R11.2 v23.35,5.24
  Bottom 0.61: v23.35,5.24 25.38,4.25 | 11.1 29.78,7.75 28.43,6.25 28.43,4.15 T11.2
N$27  (2 unrouted)
  Top 0.406: R12.2 24.88,2.01
  Top 0.61: 24.88,2.01 25.38,4.5
  Top 1.778: 12.1 25.38,4.5
N$28  (via drill 0.6)  (1 unrouted)
  Top 0.406: v22.21,7.63 22.88,9.13 22.88,9.25
  Bottom 0.813: X4.7 21.45,6.61 22.21,7.36 v22.21,7.63
N$29  (1 unrouted)
  Top 0.406: 25.38,25.9 27.38,24.19 27.38,19.12 27.37,17.59 T15.1
N$30  (via drill 0.6)  (1 unrouted)
  Top 0.406: 29.43,25.2 v29.58,22.4
  Bottom 0.406: v29.58,22.4 31.29,22.4 T14.1
N$31  (via drill 0.6)
  Top 0.61: v22.93,30.44 22.93,29.45 D13.-
  Bottom 0.406: v22.93,30.44 22.98,27.07 24.14,25.9 25.1,25.9 T13.1
N$32  (2 unrouted)
  Top 0.61: R13.2 13.1
  Bottom 0.813: 31.38,27.9 13.1
N$33  (via drill 0.6)  (2 unrouted)
  Top 0.406: R14.2 v23.35,21.89
  Bottom 0.61: v23.35,21.89 25.38,20.9 | 14.1 29.78,24.4 28.43,22.9 28.43,20.8 T14.2
N$34  (2 unrouted)
  Top 0.406: R15.2 24.88,18.66
  Top 0.61: 24.88,18.66 25.38,21.15
  Top 1.778: 15.1 25.38,21.15
N$35  (via drill 0.6)  (1 unrouted)
  Top 0.406: v22.21,24.28 22.88,25.78 22.88,25.9
  Bottom 0.813: X5.7 21.45,23.26 22.21,24.01 v22.21,24.28
N$36  (1 unrouted)
  Top 0.406: 25.38,42.55 27.38,40.84 27.38,35.77 27.37,34.24 T18.1
N$37  (via drill 0.6)  (1 unrouted)
  Top 0.406: 29.43,41.85 v29.58,39.05
  Bottom 0.406: v29.58,39.05 31.29,39.05 T17.1
N$38  (via drill 0.6)
  Top 0.61: v22.93,47.09 22.93,46.1 D16.-
  Bottom 0.406: v22.93,47.09 22.98,43.72 24.14,42.55 25.1,42.55 T16.1
N$39  (2 unrouted)
  Top 0.61: R16.2 16.1
  Bottom 0.813: 31.38,44.55 16.1
N$40  (via drill 0.6)  (2 unrouted)
  Top 0.406: R17.2 v23.35,38.54
  Bottom 0.61: v23.35,38.54 25.38,37.55 | 17.1 29.78,41.05 28.43,39.55 28.43,37.45 T17.2
N$41  (2 unrouted)
  Top 0.406: R18.2 24.88,35.31
  Top 0.61: 24.88,35.31 25.38,37.8
  Top 1.778: 18.1 25.38,37.8
N$42  (via drill 0.6)  (1 unrouted)
  Top 0.406: v22.21,40.93 22.88,42.43 22.88,42.55
  Bottom 0.813: X6.7 21.45,39.91 22.21,40.66 v22.21,40.93
N$43  (1 unrouted)
  Top 0.406: 41.28,39.8 39.28,41.51 39.28,46.58 39.3,48.11 T21.1
N$44  (via drill 0.6)  (1 unrouted)
  Top 0.406: 37.23,40.5 v37.08,43.3
  Bottom 0.406: v37.08,43.3 35.37,43.3 T20.1
N$45  (via drill 0.6)
  Top 0.61: v43.73,35.26 43.73,36.25 D19.-
  Bottom 0.406: v43.73,35.26 43.69,38.63 42.52,39.8 41.57,39.8 T19.1
N$46  (2 unrouted)
  Top 0.61: R19.2 19.1
  Bottom 0.813: 35.28,37.8 19.1
N$47  (via drill 0.6)  (2 unrouted)
  Top 0.406: R20.2 v43.31,43.81
  Bottom 0.61: v43.31,43.81 41.28,44.8 | 20.1 36.88,41.3 38.23,42.8 38.23,44.9 T20.2
N$48  (2 unrouted)
  Top 0.406: R21.2 41.78,47.04
  Top 0.61: 41.78,47.04 41.28,44.55
  Top 1.778: 21.1 41.28,44.55
N$49  (via drill 0.6)  (1 unrouted)
  Top 0.406: v44.45,41.42 43.78,39.92 43.78,39.8
  Bottom 0.813: X7.7 45.21,42.44 44.45,41.69 v44.45,41.42
N$50  (1 unrouted)
  Top 0.406: 41.28,23.15 39.28,24.86 39.28,29.93 39.3,31.46 T24.1
N$51  (via drill 0.6)  (1 unrouted)
  Top 0.406: 37.23,23.85 v37.08,26.65
  Bottom 0.406: v37.08,26.65 35.37,26.65 T23.1
N$52  (via drill 0.6)
  Top 0.61: v43.73,18.61 43.73,19.6 D22.-
  Bottom 0.406: v43.73,18.61 43.69,21.98 42.52,23.15 41.57,23.15 T22.1
N$53  (2 unrouted)
  Top 0.61: R22.2 22.1
  Bottom 0.813: 35.28,21.15 22.1
N$54  (via drill 0.6)  (2 unrouted)
  Top 0.406: R23.2 v43.31,27.16
  Bottom 0.61: v43.31,27.16 41.28,28.15 | 23.1 36.88,24.65 38.23,26.15 38.23,28.25 T23.2
N$55  (2 unrouted)
  Top 0.406: R24.2 41.78,30.39
  Top 0.61: 41.78,30.39 41.28,27.9
  Top 1.778: 24.1 41.28,27.9
N$56  (via drill 0.6)  (1 unrouted)
  Top 0.406: v44.45,24.77 43.78,23.27 43.78,23.15
  Bottom 0.813: X8.7 45.21,25.79 44.45,25.04 v44.45,24.77
N$57  (1 unrouted)
  Top 0.406: 41.28,6.5 39.28,8.21 39.28,13.28 39.3,14.81 T27.1
N$58  (via drill 0.6)  (1 unrouted)
  Top 0.406: 37.23,7.2 v37.08,10
  Bottom 0.406: v37.08,10 35.37,10 T26.1
N$59  (via drill 0.6)
  Top 0.61: v43.73,1.96 43.73,2.95 D25.-
  Bottom 0.406: v43.73,1.96 43.69,5.33 42.52,6.5 41.57,6.5 T25.1
N$60  (2 unrouted)
  Top 0.61: R25.2 25.1
  Bottom 0.813: 35.28,4.5 25.1
N$61  (via drill 0.6)  (2 unrouted)
  Top 0.406: R26.2 v43.31,10.51
  Bottom 0.61: v43.31,10.51 41.28,11.5 | 26.1 36.88,8 38.23,9.5 38.23,11.6 T26.2
N$62  (2 unrouted)
  Top 0.406: R27.2 41.78,13.74
  Top 0.61: 41.78,13.74 41.28,11.25
  Top 1.778: 27.1 41.28,11.25
N$63  (via drill 0.6)  (1 unrouted)
  Top 0.406: v44.45,8.12 43.78,6.62 43.78,6.5
  Bottom 0.813: X9.7 45.21,9.14 44.45,8.39 v44.45,8.12
RTS  (8 unrouted)
  Top 0.406: 4.19,8.95 4.99,10.75 9.79,10.75 | 4.19,25.6 4.99,27.4 9.79,27.4 | 4.19,42.25 4.99,44.05 9.79,44.05 | 21.08,8.95 21.88,10.75 26.68,10.75 | 21.08,25.6 21.88,27.4 26.68,27.4 | 21.08,42.25 21.88,44.05 26.68,44.05 | 45.58,40.1 44.78,38.3 39.98,38.3 | 45.58,23.45 44.78,21.65 39.98,21.65 | 45.58,6.8 44.78,5 39.98,5
  Top 0.61: 9.79,10.75 9.94,10.85 10.69,11.6 D2.+ | 9.79,27.4 9.94,27.5 10.69,28.25 D5.+ | 9.79,44.05 9.94,44.15 10.69,44.9 D8.+ | 26.68,10.75 26.83,10.85 27.58,11.6 D11.+ | 26.68,27.4 26.83,27.5 27.58,28.25 D14.+ | 26.68,44.05 26.83,44.15 27.58,44.9 D17.+ | 39.98,38.3 39.83,38.2 39.08,37.45 D20.+ | 39.98,21.65 39.83,21.55 39.08,20.8 D23.+ | 39.98,5 39.83,4.9 39.08,4.15 D26.+
  Top 0.813: X3.3 3.19,8 4.19,8.95 | X1.3 3.19,24.65 4.19,25.6 | X2.3 3.19,41.3 4.19,42.25 | X4.3 20.08,8 21.08,8.95 | X5.3 20.08,24.65 21.08,25.6 | X6.3 20.08,41.3 21.08,42.25 | X7.3 46.58,41.05 45.58,40.1 | X8.3 46.58,24.4 45.58,23.45 | X9.3 46.58,7.75 45.58,6.8
(copper drawn outside any net)
  shapes: Bottom area x9, Top area x9